# EAGLE design PCB-BI8-3x5C3 (EAGLE 7.1.0)

## Sheet 1 of 2
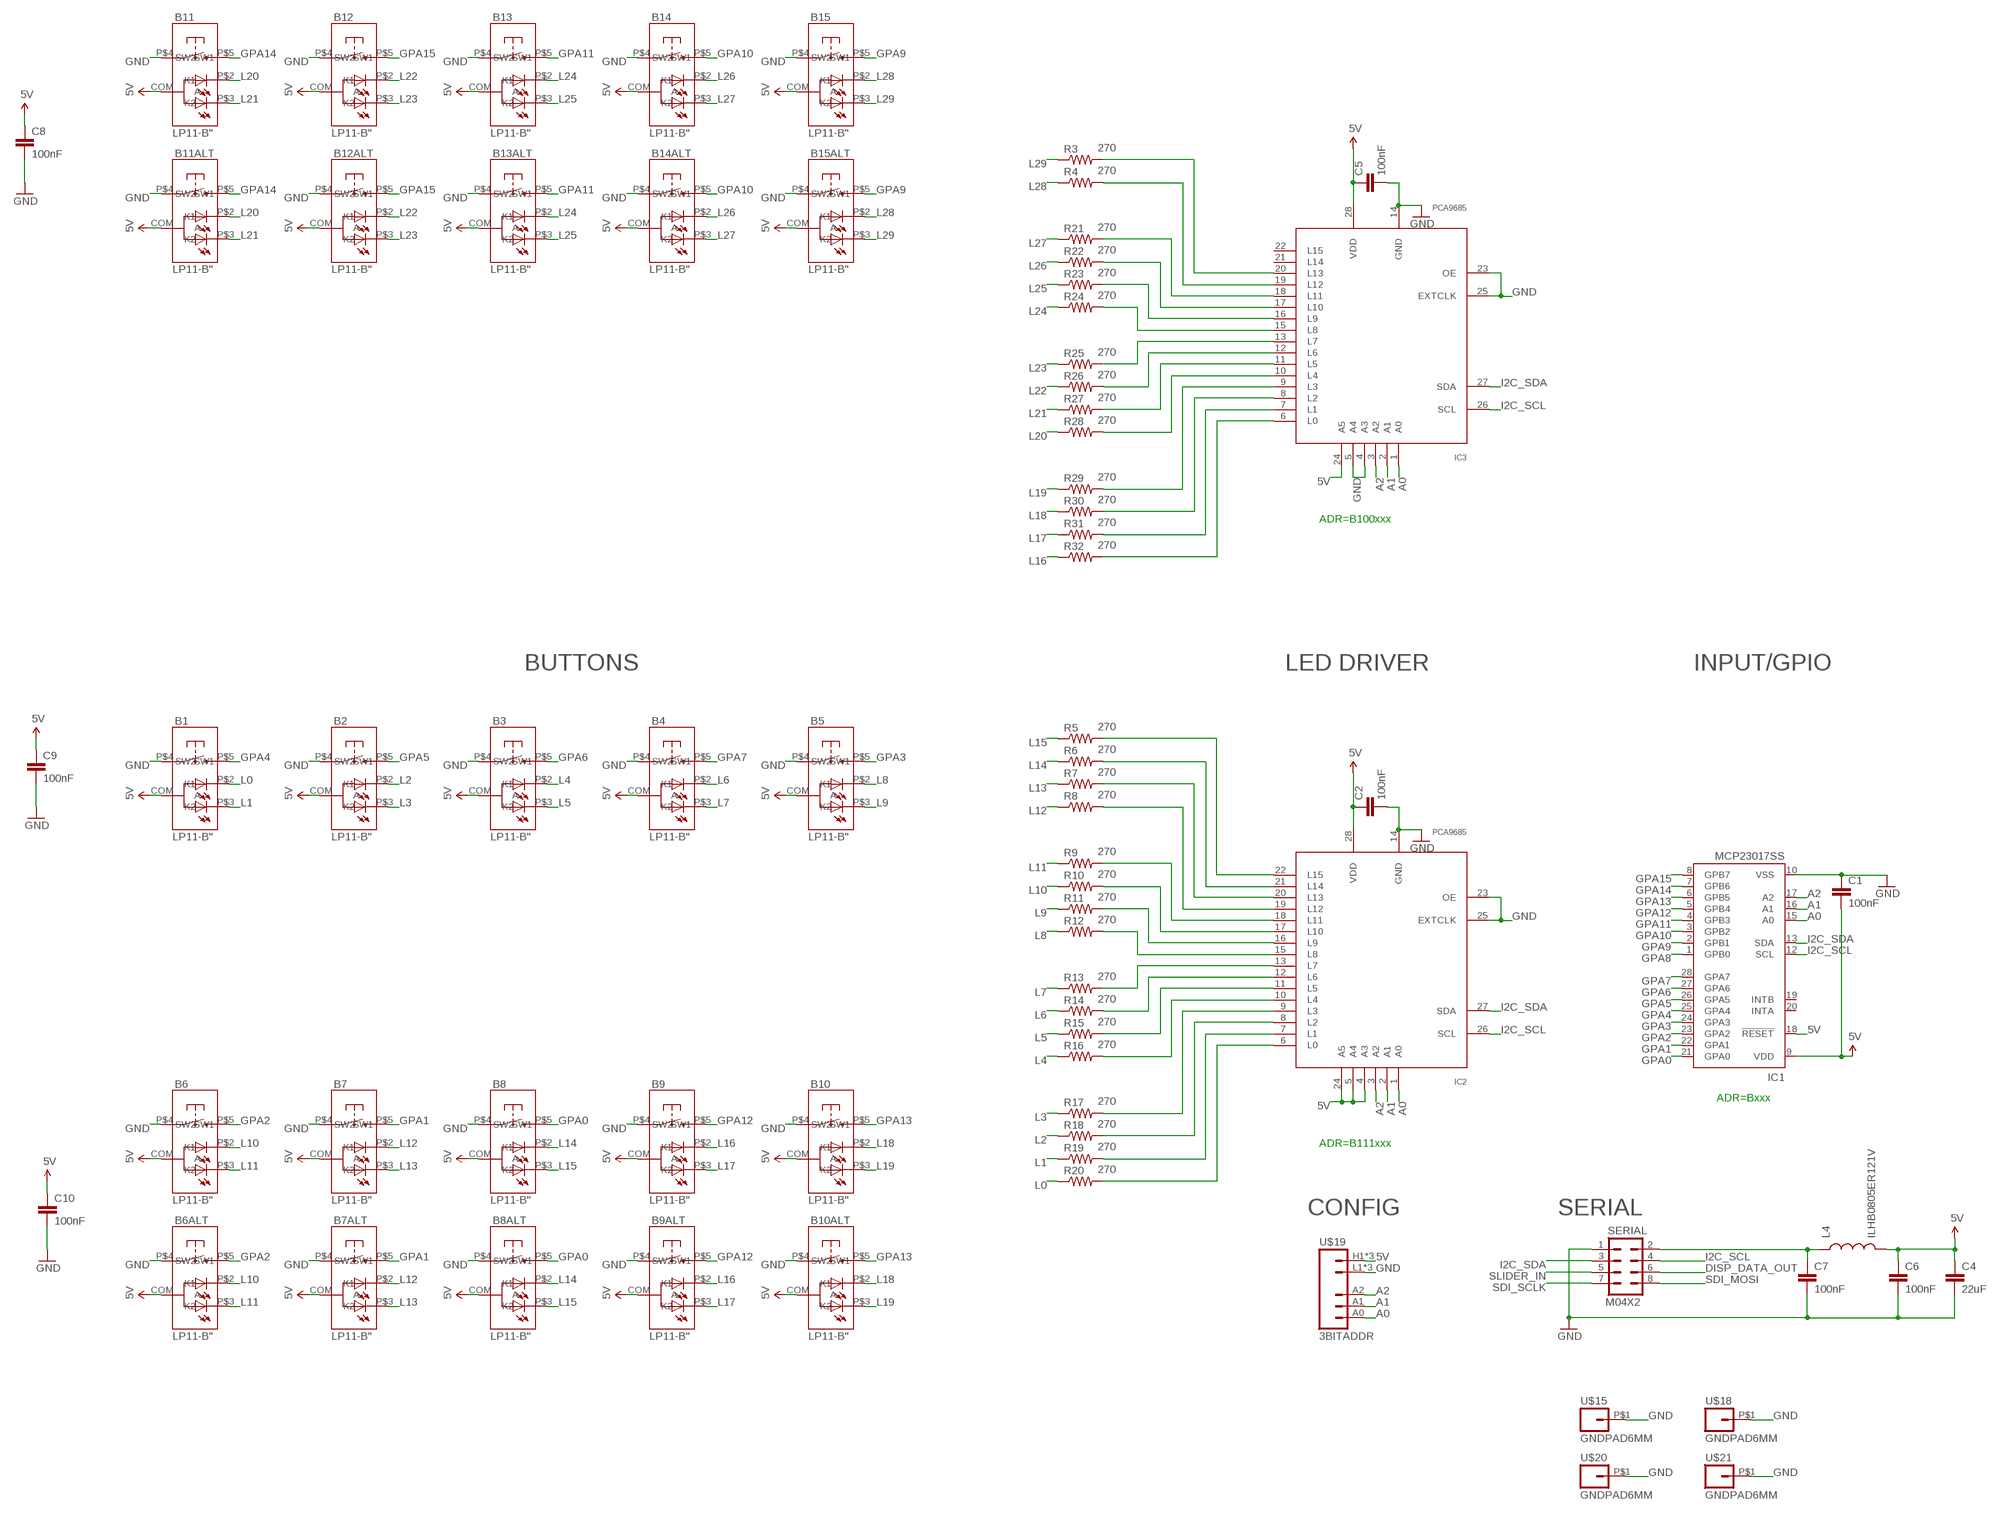
[diagram p0: schematic, sheet 1]

### Parts
B1  LP11-B"  [LP11]
B2  LP11-B"  [LP11]
B3  LP11-B"  [LP11]
B4  LP11-B"  [LP11]
B5  LP11-B"  [LP11]
B6  LP11-B"  [LP11]
B6ALT  LP11-B"  [LP11]
B7  LP11-B"  [LP11]
B7ALT  LP11-B"  [LP11]
B8  LP11-B"  [LP11]
B8ALT  LP11-B"  [LP11]
B9  LP11-B"  [LP11]
B9ALT  LP11-B"  [LP11]
B10  LP11-B"  [LP11]
B10ALT  LP11-B"  [LP11]
B11  LP11-B"  [LP11]
B11ALT  LP11-B"  [LP11]
B12  LP11-B"  [LP11]
B12ALT  LP11-B"  [LP11]
B13  LP11-B"  [LP11]
B13ALT  LP11-B"  [LP11]
B14  LP11-B"  [LP11]
B14ALT  LP11-B"  [LP11]
B15  LP11-B"  [LP11]
B15ALT  LP11-B"  [LP11]
C1  100nF  CAP0603-CAP  [0603-CAP]
C2  100nF  CAP0603-CAP  [0603-CAP]
C4  22uF  CAP0805  [0805]
C5  100nF  CAP0603-CAP  [0603-CAP]
C6  100nF  CAP0603-CAP  [0603-CAP]
C7  100nF  CAP0603-CAP  [0603-CAP]
C8  100nF  CAP0603-CAP  [0603-CAP]
C9  100nF  CAP0603-CAP  [0603-CAP]
C10  100nF  CAP0603-CAP  [0603-CAP]
IC1  MCP23017SS  [SSOP28]
IC2  PCA9685  [TSSOP28]
IC3  PCA9685  [TSSOP28]
L4  ILHB0805ER121V  INDUCTOR0805  [0805]
R3  270  RESISTOR0603-RES  [0603-RES]
R4  270  RESISTOR0603-RES  [0603-RES]
R5  270  RESISTOR0603-RES  [0603-RES]
R6  270  RESISTOR0603-RES  [0603-RES]
R7  270  RESISTOR0603-RES  [0603-RES]
R8  270  RESISTOR0603-RES  [0603-RES]
R9  270  RESISTOR0603-RES  [0603-RES]
R10  270  RESISTOR0603-RES  [0603-RES]
R11  270  RESISTOR0603-RES  [0603-RES]
R12  270  RESISTOR0603-RES  [0603-RES]
R13  270  RESISTOR0603-RES  [0603-RES]
R14  270  RESISTOR0603-RES  [0603-RES]
R15  270  RESISTOR0603-RES  [0603-RES]
R16  270  RESISTOR0603-RES  [0603-RES]
R17  270  RESISTOR0603-RES  [0603-RES]
R18  270  RESISTOR0603-RES  [0603-RES]
R19  270  RESISTOR0603-RES  [0603-RES]
R20  270  RESISTOR0603-RES  [0603-RES]
R21  270  RESISTOR0603-RES  [0603-RES]
R22  270  RESISTOR0603-RES  [0603-RES]
R23  270  RESISTOR0603-RES  [0603-RES]
R24  270  RESISTOR0603-RES  [0603-RES]
R25  270  RESISTOR0603-RES  [0603-RES]
R26  270  RESISTOR0603-RES  [0603-RES]
R27  270  RESISTOR0603-RES  [0603-RES]
R28  270  RESISTOR0603-RES  [0603-RES]
R29  270  RESISTOR0603-RES  [0603-RES]
R30  270  RESISTOR0603-RES  [0603-RES]
R31  270  RESISTOR0603-RES  [0603-RES]
R32  270  RESISTOR0603-RES  [0603-RES]
SERIAL  M04X2  [2X4]
U$15  GNDPAD6MM  [3.2MMPAD6MM]
U$18  GNDPAD6MM  [3.2MMPAD6MM]
U$19  3BITADDR  [3BITADDR]
U$20  GNDPAD6MM  [3.2MMPAD6MM]
U$21  GNDPAD6MM  [3.2MMPAD6MM]

### Nets
5V [Power]: B1.COM(A) B2.COM(A) B3.COM(A) B4.COM(A) B5.COM(A) B6.COM(A) B6ALT.COM(A) B7.COM(A) B7ALT.COM(A) B8.COM(A) B8ALT.COM(A) B9.COM(A) B9ALT.COM(A) B10.COM(A) B10ALT.COM(A) B11.COM(A) B11ALT.COM(A) B12.COM(A) B12ALT.COM(A) B13.COM(A) B13ALT.COM(A) B14.COM(A) B14ALT.COM(A) B15.COM(A) B15ALT.COM(A) C1.2 C2.1 C4.1 C5.1 C6.1 C8.1 C9.1 C10.1 IC1.9(VDD) IC1.18(!RESET) IC2.4(A3) IC2.5(A4) IC2.24(A5) IC2.28(VDD) IC3.24(A5) IC3.28(VDD) L4.2 U$19.H1(VCC) U$19.H2(VCC) U$19.H3(VCC)
A0: IC1.15(A0) IC2.1(A0) IC3.1(A0) U$19.A0
A1: IC1.16(A1) IC2.2(A1) IC3.2(A1) U$19.A1
A2: IC1.17(A2) IC2.3(A2) IC3.3(A2) U$19.A2
DISP_DATA_OUT: SERIAL.6
GND [Power]: B1.P$4(SW1) B2.P$4(SW1) B3.P$4(SW1) B4.P$4(SW1) B5.P$4(SW1) B6.P$4(SW1) B6ALT.P$4(SW1) B7.P$4(SW1) B7ALT.P$4(SW1) B8.P$4(SW1) B8ALT.P$4(SW1) B9.P$4(SW1) B9ALT.P$4(SW1) B10.P$4(SW1) B10ALT.P$4(SW1) B11.P$4(SW1) B11ALT.P$4(SW1) B12.P$4(SW1) B12ALT.P$4(SW1) B13.P$4(SW1) B13ALT.P$4(SW1) B14.P$4(SW1) B14ALT.P$4(SW1) B15.P$4(SW1) B15ALT.P$4(SW1) C1.1 C2.2 C4.2 C5.2 C6.2 C7.2 C8.2 C9.2 C10.2 IC1.10(VSS) IC2.14(GND) IC2.23(OE) IC2.25(EXTCLK) IC3.4(A3) IC3.5(A4) IC3.14(GND) IC3.23(OE) IC3.25(EXTCLK) SERIAL.1 U$15.P$1 U$18.P$1 U$19.L1(GND) U$19.L2(GND) U$19.L3(GND) U$20.P$1 U$21.P$1
GPA0: B8.P$5(SW2) B8ALT.P$5(SW2) IC1.21(GPA0)
GPA1: B7.P$5(SW2) B7ALT.P$5(SW2) IC1.22(GPA1)
GPA2: B6.P$5(SW2) B6ALT.P$5(SW2) IC1.23(GPA2)
GPA3: B5.P$5(SW2) IC1.24(GPA3)
GPA4: B1.P$5(SW2) IC1.25(GPA4)
GPA5: B2.P$5(SW2) IC1.26(GPA5)
GPA6: B3.P$5(SW2) IC1.27(GPA6)
GPA7: B4.P$5(SW2) IC1.28(GPA7)
GPA8: IC1.1(GPB0)
GPA9: B15.P$5(SW2) B15ALT.P$5(SW2) IC1.2(GPB1)
GPA10: B14.P$5(SW2) B14ALT.P$5(SW2) IC1.3(GPB2)
GPA11: B13.P$5(SW2) B13ALT.P$5(SW2) IC1.4(GPB3)
GPA12: B9.P$5(SW2) B9ALT.P$5(SW2) IC1.5(GPB4)
GPA13: B10.P$5(SW2) B10ALT.P$5(SW2) IC1.6(GPB5)
GPA14: B11.P$5(SW2) B11ALT.P$5(SW2) IC1.7(GPB6)
GPA15: B12.P$5(SW2) B12ALT.P$5(SW2) IC1.8(GPB7)
I2C_SCL: IC1.12(SCL) IC2.26(SCL) IC3.26(SCL) SERIAL.4
I2C_SDA: IC1.13(SDA) IC2.27(SDA) IC3.27(SDA) SERIAL.3
L0: B1.P$2(K1) R20.1
L1: B1.P$3(K2) R19.1
L2: B2.P$2(K1) R18.1
L3: B2.P$3(K2) R17.1
L4: B3.P$2(K1) R16.1
L5: B3.P$3(K2) R15.1
L6: B4.P$2(K1) R14.1
L7: B4.P$3(K2) R13.1
L8: B5.P$2(K1) R12.1
L9: B5.P$3(K2) R11.1
L10: B6.P$2(K1) B6ALT.P$2(K1) R10.1
L11: B6.P$3(K2) B6ALT.P$3(K2) R9.1
L12: B7.P$2(K1) B7ALT.P$2(K1) R8.1
L13: B7.P$3(K2) B7ALT.P$3(K2) R7.1
L14: B8.P$2(K1) B8ALT.P$2(K1) R6.1
L15: B8.P$3(K2) B8ALT.P$3(K2) R5.1
L16: B9.P$2(K1) B9ALT.P$2(K1) R32.1
L17: B9.P$3(K2) B9ALT.P$3(K2) R31.1
L18: B10.P$2(K1) B10ALT.P$2(K1) R30.1
L19: B10.P$3(K2) B10ALT.P$3(K2) R29.1
L20: B11.P$2(K1) B11ALT.P$2(K1) R28.1
L21: B11.P$3(K2) B11ALT.P$3(K2) R27.1
L22: B12.P$2(K1) B12ALT.P$2(K1) R26.1
L23: B12.P$3(K2) B12ALT.P$3(K2) R25.1
L24: B13.P$2(K1) B13ALT.P$2(K1) R24.1
L25: B13.P$3(K2) B13ALT.P$3(K2) R23.1
L26: B14.P$2(K1) B14ALT.P$2(K1) R22.1
L27: B14.P$3(K2) B14ALT.P$3(K2) R21.1
L28: B15.P$2(K1) B15ALT.P$2(K1) R4.1
L29: B15.P$3(K2) B15ALT.P$3(K2) R3.1
N$1: IC3.13(L7) R25.2
N$2: IC3.12(L6) R26.2
N$3: IC3.11(L5) R27.2
N$4: IC2.13(L7) R13.2
N$5: IC2.12(L6) R14.2
N$6: IC3.10(L4) R28.2
N$7: IC2.11(L5) R15.2
N$8: IC3.9(L3) R29.2
N$9: IC2.10(L4) R16.2
N$10: IC2.9(L3) R17.2
N$11: IC2.8(L2) R18.2
N$12: IC2.7(L1) R19.2
N$13: IC3.8(L2) R30.2
N$14: IC3.7(L1) R31.2
N$15: IC3.6(L0) R32.2
N$16: IC3.15(L8) R24.2
N$17: IC3.16(L9) R23.2
N$18: IC3.17(L10) R22.2
N$19: IC2.6(L0) R20.2
N$20: IC2.15(L8) R12.2
N$21: IC2.16(L9) R11.2
N$22: IC2.17(L10) R10.2
N$23: IC2.18(L11) R9.2
N$24: IC2.19(L12) R8.2
N$25: IC2.20(L13) R7.2
N$26: IC2.21(L14) R6.2
N$27: IC2.22(L15) R5.2
N$28: IC3.18(L11) R21.2
N$29: IC3.19(L12) R4.2
N$30: IC3.20(L13) R3.2
N$33 [Power]: C7.1 L4.1 SERIAL.2
SDI_MOSI: SERIAL.8
SDI_SCLK: SERIAL.7
SLIDER_IN: SERIAL.5
Unconnected: IC1.19(INTB) IC1.20(INTA) IC3.21(L14) IC3.22(L15)

### Notes on the sheet
- ADR=B100xxx
- BUTTONS | LED DRIVER | INPUT/GPIO
- ADR=Bxxx
- ADR=B111xxx
- CONFIG | SERIAL

## Sheet 2 of 2

## Library data of the parts
B1-B6 B6ALT B7 B7ALT B8 B8ALT B9 B9ALT B10 B10ALT B11 B11ALT B12 B12ALT B13 B13ALT B14 B14ALT B15 B15ALT = SKAARHOJ:LP11-B
C1 C2 C4-C10 = SparkFun:CAP: Capacitor Standard 0603 ceramic capacitor, and 0.1" leaded capacitor.
IC1 = microchip:MCP23017: http://ww1.microchip.com/downloads/en/DeviceDoc/21952a.pdf Source: http://ww1.microchip.com/downloads/en/DeviceDoc/21952a.pdf; MF: MICROCHIP; MPN: MCP23017-E/SS; OC_FARNELL: 1467674; OC_NEWARK: 31K2960
IC2 IC3 = wsmith:PCA9685
L4 = SparkFun:INDUCTOR: Inductors Basic Inductor/Choke - 0603 and 1206. Footprints are not proven and vary greatly between part numbers.
R3-R32 = SparkFun:RESISTOR: Resistor Basic schematic elements and footprints for 0603, 1206, and PTH resistors.
SERIAL = SparkFun:M04X2
U$15 U$18 U$20 U$21 = SKAARHOJ:GNDPAD
U$19 = SKAARHOJ:3BITADDR

## Net classes
0 default: width 0.203 mm, drill 0.406 mm, clearance 0.203 mm
1 Power: width 0.406 mm, drill 0.61 mm, clearance 0.203 mm

## Board
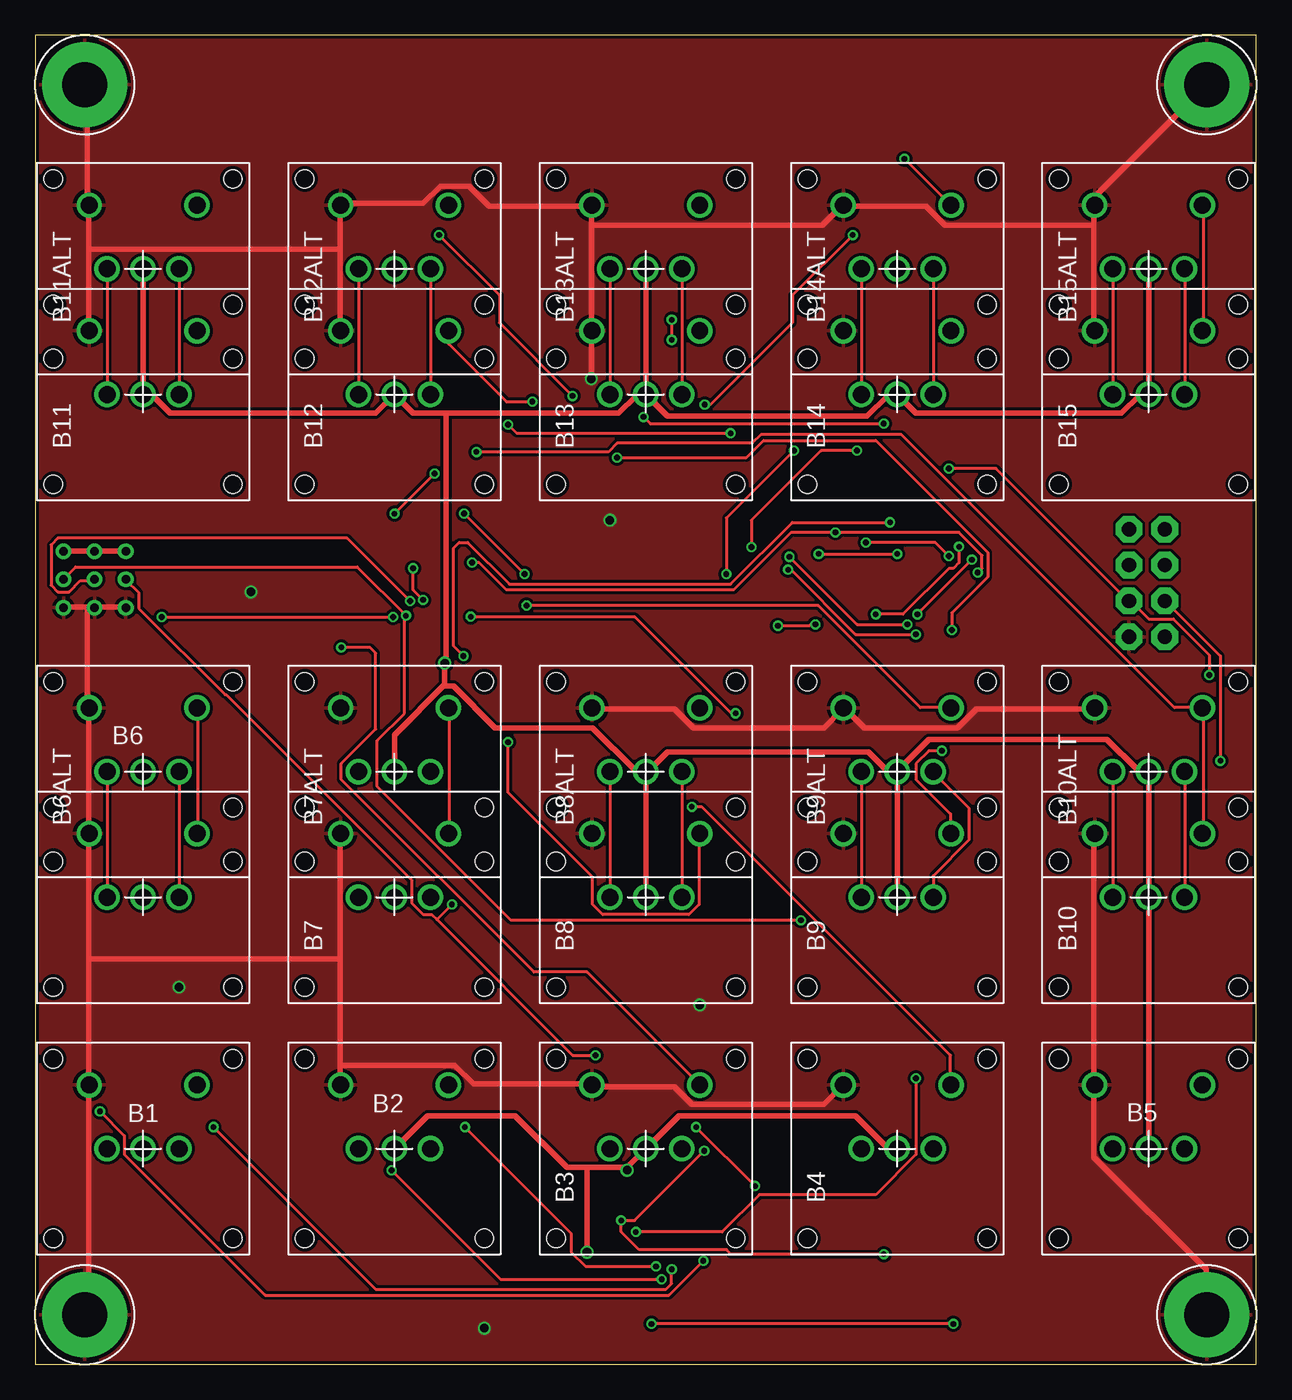
[diagram p1: board, top side]
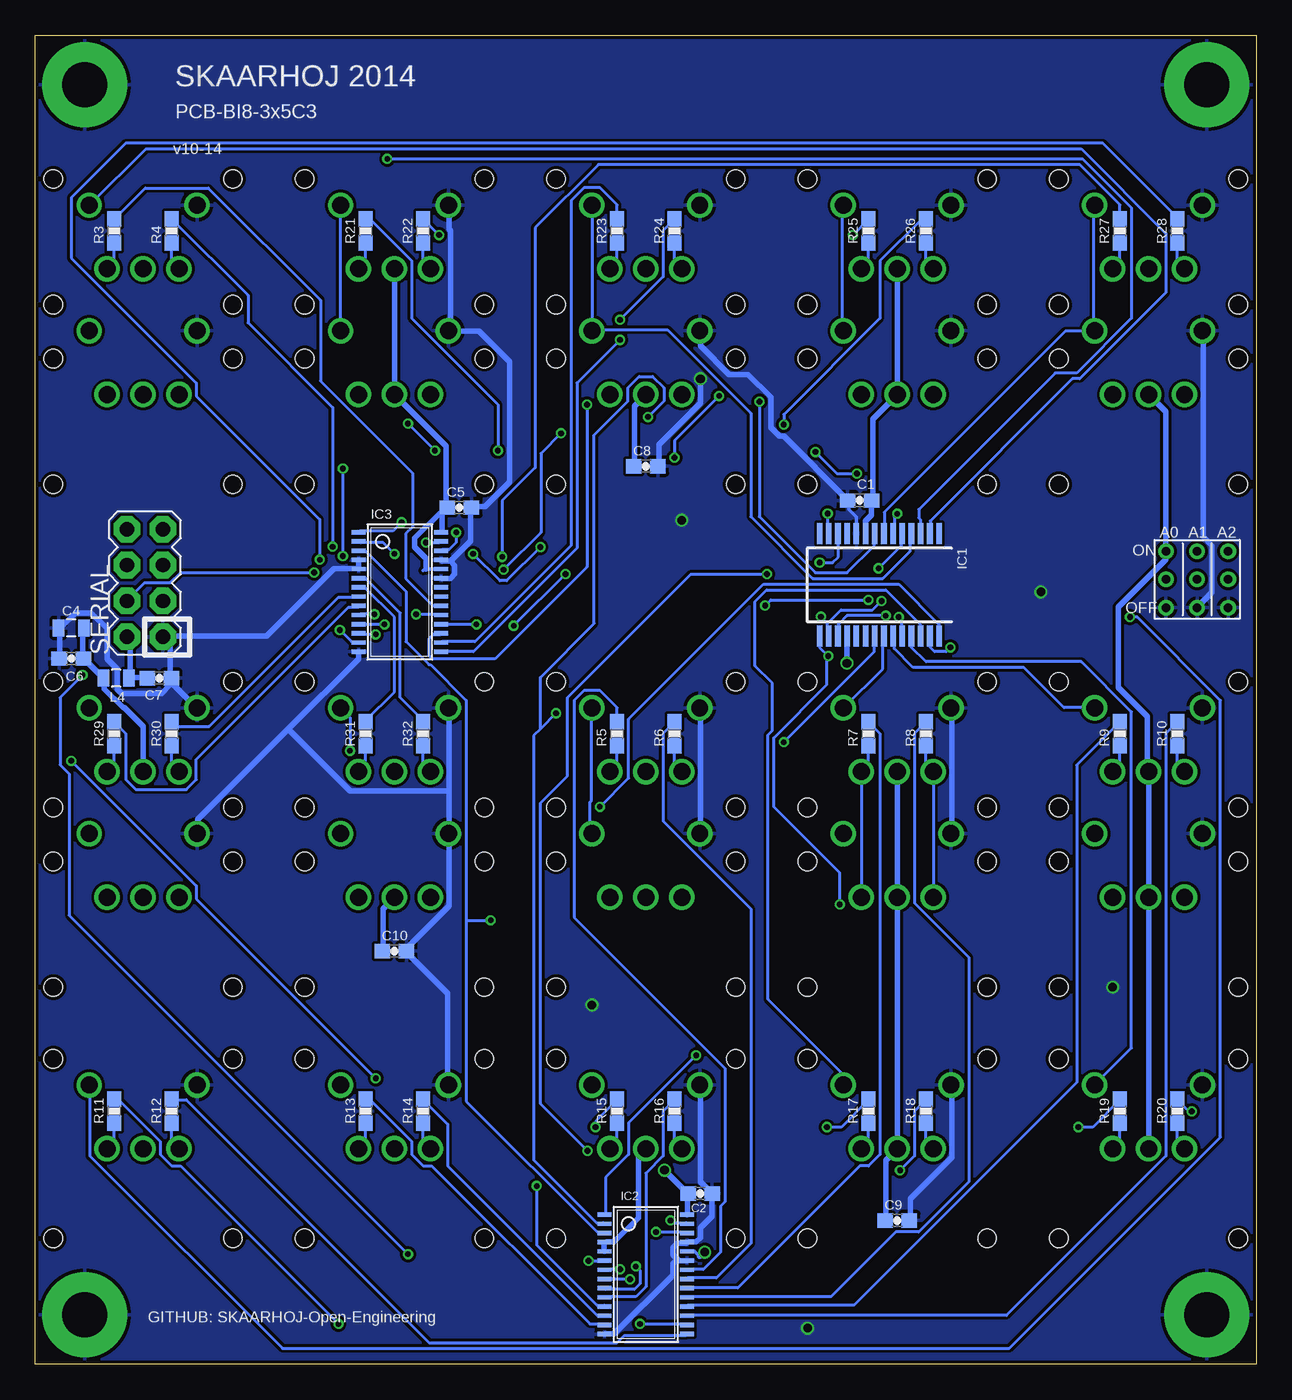
[diagram p2: board, bottom side, seen from below]

Size 86.36 x 93.98 mm. Coordinates in mm from the lower left corner, seen from the top.
Outline: 0,0 86.36,0 86.36,93.98 0,93.98 0,0
Copper layers (1*16): Top 0.035mm / dielectric 1.5mm / Bottom 0.035mm
Design rules "Fusion_eagle_rule_v1.1": minimum track width 6mil, minimum drill 12mil, track to track 6mil, track to pad 6mil, pad to pad 6mil, via to via 6mil, smd to smd 0mil, copper to edge 10mil, drill to drill 10mil, minimum pad ring 10mil, minimum via ring 6mil, stop-mask expansion 2mil, vias tented up to drill 100mil, thermal gap 10mil

### Footprints (pad centres in the part's own frame; a part is rotated, then mirrored left to right if it is on the bottom)
LP11 = drill 1.2: COM 0,0; P$2 0,2.54; P$3 0,-2.54; P$4 4.5,3.81; P$5 4.5,-3.81 | hole 1.3: -6.35,6.35; 6.35,6.35; 6.35,-6.35; -6.35,-6.35
0603-CAP = smd 1.1 x 1: 1 -0.85,0; 2 0.85,0
0805 = smd 0.8 x 1.2: 1 -0.9,0; 2 0.9,0
SSOP28 = smd 0.4 x 1.5: 1 -4.225,-3.625; 2 -3.575,-3.625; 3 -2.925,-3.625; 4 -2.275,-3.625; 5 -1.625,-3.625; 6 -0.975,-3.625; 7 -0.325,-3.625; 8 0.325,-3.625; 9 0.975,-3.625; 10 1.625,-3.625; 11 2.275,-3.625; 12 2.925,-3.625; 13 3.575,-3.625; 14 4.225,-3.625; 15 4.225,3.625; 16 3.575,3.625; 17 2.925,3.625; 18 2.275,3.625; 19 1.625,3.625; 20 0.975,3.625; 21 0.325,3.625; 22 -0.325,3.625; 23 -0.975,3.625; 24 -1.625,3.625; 25 -2.275,3.625; 26 -2.925,3.625; 27 -3.575,3.625; 28 -4.225,3.625
TSSOP28 = smd 0.305 x 0.991: 1 -4.225,-2.918; 2 -3.575,-2.918; 3 -2.925,-2.918; 4 -2.275,-2.918; 5 -1.625,-2.918; 6 -0.975,-2.918; 7 -0.325,-2.918; 8 0.325,-2.918; 9 0.975,-2.918; 10 1.625,-2.918; 11 2.275,-2.918; 12 2.925,-2.918; 13 3.575,-2.918; 14 4.225,-2.918; 15 4.225,2.918; 16 3.575,2.918; 17 2.925,2.918; 18 2.275,2.918; 19 1.625,2.918; 20 0.975,2.918; 21 0.325,2.918; 22 -0.325,2.918; 23 -0.975,2.918; 24 -1.625,2.918; 25 -2.275,2.918; 26 -2.925,2.918; 27 -3.575,2.918; 28 -4.225,2.918
0603-RES = smd 1.1 x 1: 1 -0.85,0; 2 0.85,0
2X4 = drill 1.016 pad 1.88 octagon: 1 -3.81,-1.27; 2 -3.81,1.27; 3 -1.27,-1.27; 4 -1.27,1.27; 5 1.27,-1.27; 6 1.27,1.27; 7 3.81,-1.27; 8 3.81,1.27
3.2MMPAD6MM = drill 3.2 pad 6: P$1 0,0
3BITADDR = drill 0.6: A0 -2.2,0; A1 0,0; A2 2.2,0; H1 -2.2,2; H2 0,2; H3 2.2,2; L1 -2.2,-2; L2 0,-2; L3 2.2,-2

### Placement (x,y rotation side)
B1  7.62,15.24 90 top
B2  25.4,15.24 90 top
B3  43.18,15.24 90 top
B4  60.96,15.24 90 top
B5  78.74,15.24 90 top
B6  7.62,33.02 90 top
B6ALT  7.62,41.91 90 top
B7  25.4,33.02 90 top
B7ALT  25.4,41.91 90 top
B8  43.18,33.02 90 top
B8ALT  43.18,41.91 90 top
B9  60.96,33.02 90 top
B9ALT  60.96,41.91 90 top
B10  78.74,33.02 90 top
B10ALT  78.74,41.91 90 top
B11  7.62,68.58 90 top
B11ALT  7.62,77.47 90 top
B12  25.4,68.58 90 top
B12ALT  25.4,77.47 90 top
B13  43.18,68.58 90 top
B13ALT  43.18,77.47 90 top
B14  60.96,68.58 90 top
B14ALT  60.96,77.47 90 top
B15  78.74,68.58 90 top
B15ALT  78.74,77.47 90 top
C1  28.07,61.09 0 bottom
C2  39.34,12.06 0 bottom
C4  83.82,52.07 180 bottom
C5  56.36,60.58 0 bottom
C6  83.82,49.91 180 bottom
C7  77.6,48.51 0 bottom
C8  43.18,63.5 0 bottom
C9  25.4,10.16 0 bottom
C10  60.96,29.21 0 bottom
IC1  26.67,55.12 180 bottom
IC2  43.18,6.35 270 bottom
IC3  60.58,54.61 270 bottom
L4  80.64,48.51 180 bottom
R3  80.77,80.14 90 bottom
R4  76.71,80.14 90 bottom
R5  45.21,44.58 90 bottom
R6  41.15,44.58 90 bottom
R7  27.43,44.58 90 bottom
R8  23.37,44.58 90 bottom
R9  9.65,44.58 90 bottom
R10  5.59,44.58 90 bottom
R11  80.77,17.91 90 bottom
R12  76.71,17.91 90 bottom
R13  62.99,17.91 90 bottom
R14  58.93,17.91 90 bottom
R15  45.21,17.91 90 bottom
R16  41.15,17.91 90 bottom
R17  27.43,17.91 90 bottom
R18  23.37,17.91 90 bottom
R19  9.65,17.91 90 bottom
R20  5.59,17.91 90 bottom
R21  62.99,80.14 90 bottom
R22  58.93,80.14 90 bottom
R23  45.21,80.14 90 bottom
R24  41.15,80.14 90 bottom
R25  27.43,80.14 90 bottom
R26  23.37,80.14 90 bottom
R27  9.65,80.14 90 bottom
R28  5.59,80.14 90 bottom
R29  80.77,44.58 90 bottom
R30  76.71,44.58 90 bottom
R31  62.99,44.58 90 bottom
R32  58.93,44.58 90 bottom
SERIAL  78.61,55.24 90 bottom
U$15  3.5,3.5 0 top
U$18  82.86,3.5 0 top
U$19  4.19,55.5 0 bottom
U$20  3.5,90.48 0 top
U$21  82.86,90.48 0 top

### Tracks (layer width: path | path; a pad name or v marks a point on that pad's centre or on a via)
5V  (via drill 0.61)
  Top 0.406: U$19.H3 2.03,57.51 4.17,57.51 U$19.H2 4.37,57.51 6.3,57.51 U$19.H1 | B11ALT.COM B11.COM 7.72,68.48 8.33,68.48 9.55,67.26 24.08,67.26 B12.COM 26.72,67.26 29.06,67.26 | B5.COM B10.COM B10ALT.COM 78.64,42.06 77.93,42.06 75.79,44.2 63.2,44.2 61.06,42.06 B9ALT.COM | B15ALT.COM B15.COM 78.64,68.48 78.03,68.48 76.81,67.26 62.28,67.26 B14.COM 60.86,68.48 60.25,68.48 58.83,67.06 44.7,67.06 B13.COM | B13.COM B13ALT.COM | 29.06,67.26 41.25,67.26 42.47,68.48 43.08,68.48 B13.COM | B4.COM 60.35,15.24 58.01,17.58 45.52,17.58 B3.COM 41.86,13.92 v41.86,13.72 41.76,13.92 39.01,13.92 | B9.COM B9ALT.COM | B8ALT.COM B8.COM | 28.96,48.06 v28.96,49.58 29.06,49.68 29.06,67.26 | 28.96,48.06 25.4,44.5 B7ALT.COM | B8ALT.COM 43.08,42.06 42.37,42.06 39.42,45.01 32.51,45.01 29.57,47.95 29.06,47.95 28.96,48.06 | B9ALT.COM 60.86,42.06 60.15,42.06 58.93,43.28 44.7,43.28 43.38,41.96 B8ALT.COM | 39.01,13.92 37.59,13.92 33.93,17.58 27.74,17.58 B2.COM | 39.01,13.92 v39.01,7.92
  Bottom 0.254: IC3.24 58.74,56.23 58.83,56.23 58.93,56.13 | IC2.24 39.73,7.97 39.4,7.64 39.37,7.62
  Bottom 0.406: B11.COM 6.4,67.36 U$19.H1 6.4,57.3 6.4,56.9 9.75,53.54 9.75,47.85 7.72,45.82 7.72,42.06 B6ALT.COM B6.COM B1.COM | C4.1 83.01,52.02 83.01,50.09 C6.1 82.91,49.89 81.58,48.56 L4.2 81.48,48.36 81.48,47.75 80.16,46.43 80.06,46.43 78.74,45.11 B10ALT.COM | 57.61,60.25 57.61,58.93 IC3.28 | 57.61,60.25 57.3,60.55 C5.1 57.3,60.76 57.3,64.92 B14.COM B14ALT.COM | B13.COM 43.99,67.77 43.99,63.5 C8.1 | IC1.9 27.64,58.83 27.64,59.64 27.23,60.05 27.23,61.06 C1.2 27.13,61.27 27.13,66.85 B12.COM B12ALT.COM | IC2.28 40.23,10.67 40.23,11.99 C2.1 40.34,12.19 v41.86,13.72 | IC2.5 46.13,8.03 46.13,8.53 IC2.4 45.92,8.64 45.41,8.64 43.69,10.36 43.69,14.73 B3.COM | B9.COM 61.77,32.21 61.77,29.26 C10.1 | C9.1 26.21,10.16 26.21,14.43 B2.COM B7.COM B7ALT.COM | v28.96,49.58 28.96,51.41 IC1.18 | 58.74,56.23 58.74,56.99 59.53,57.78 59.53,58.42 57.78,60.17 57.61,60.25 | 39.4,7.64 39.12,7.92 v39.01,7.92
A0  (via drill 0.41)
  Top 0.203: v60.45,59.54 53.54,59.54 49.17,55.17 33.53,55.17 30.58,58.12 29.97,58.12 29.57,57.71 29.57,50.8 v30.28,50.09 | v39.62,21.84 38,21.84 28.4,31.45 | 28.4,31.45 28.04,31.8 27.43,31.8 26.62,32.61 26.62,34.24 13.51,47.35 13.41,47.35 7.32,53.44 7.32,54.56 6.4,55.47 U$19.A0 | 28.4,31.45 v29.46,32.51
  Bottom 0.203: v60.45,59.54 61.06,58.93 63.4,58.93 IC3.1 | IC1.15 30.89,51.41 30.89,50.7 v30.28,50.09 30.38,50.09 30.38,48.06 34.14,44.3 34.14,39.42 29.46,34.75 v29.46,32.51 | v39.62,21.84 44.4,17.07 44.4,14.83 46.02,13.21 46.02,10.67 IC2.1
A1  (via drill 0.41)
  Top 0.203: v49.53,46.04 49.21,46.04 42.39,52.86 v30.8,52.86 | v55.4,57.31 v60.96,57.31 | v50.64,57.78 50.64,59.69 55.56,64.61 v58.1,64.61 | v60.01,66.52 43.5,66.52 v43.02,66.99 | v26.51,53.98 22.07,58.42 1.59,58.42 1.11,57.94 1.11,55.09 1.59,54.61 2.38,54.61 3.17,55.4 4.13,55.4 U$19.A1
  Bottom 0.203: v49.53,46.04 50.64,44.93 | 50.64,44.93 51.12,44.45 51.12,14.45 46.67,10 46.2,10 IC2.2 | 30.32,52.39 v30.8,52.86 | 30.32,52.39 30.32,51.59 IC1.16 | v60.96,57.31 61.75,58.1 63.34,58.1 IC3.2 | v55.4,57.31 53.5,55.4 53.02,55.4 v50.64,57.78 | v60.01,66.52 v58.1,64.61 | v43.02,66.99 41.91,68.1 41.91,69.06 42.7,69.85 43.66,69.85 44.45,69.06 44.45,68.1 46.83,65.72 46.83,52.39 50.64,48.58 50.64,44.93 | v26.51,53.98 27.15,53.34 29.37,53.34 30.32,52.39
A2  (via drill 0.41)
  Top 0.203: U$19.A2 2.03,55.58 2.85,56.39 22.76,56.39 v26.21,52.93 26.11,52.93 26.11,46.02 24.18,44.09 24.18,40.84 33.63,31.39 v54.15,31.39
  Bottom 0.203: v26.21,52.93 28.96,52.93 29.57,52.32 29.57,51.51 IC1.17 | 55.88,31.39 55.88,46.94 58.42,49.48 58.52,49.48 60.15,51.1 60.15,54.66 62.99,57.51 63.4,57.51 IC3.3 | 55.88,31.39 55.88,18.59 46.63,9.35 46.13,9.35 IC2.3 | 55.88,31.39 v54.15,31.39
GND  (via drill 0.6, 0.61)
  Top 0.406: 21.54,78.84 21.54,81.89 B12ALT.P$4 21.74,82.09 27.43,82.09 28.65,83.31 30.68,83.31 32.11,81.89 39.12,81.89 B13ALT.P$4 39.32,81.89 39.32,80.57 | 21.54,78.84 21.54,73.15 B12.P$4 | 3.76,78.84 3.76,81.89 B11ALT.P$4 3.66,82.09 3.66,90.32 U$20.P$1 | 3.76,78.84 3.76,73.15 B11.P$4 | 3.76,78.84 21.54,78.84 | v39.32,69.7 39.32,73.05 B13.P$4 39.32,73.25 39.32,80.57 | 74.88,80.57 74.88,81.89 B15ALT.P$4 75.08,82.09 75.08,82.7 U$21.P$1 | 74.88,80.57 74.88,73.15 B15.P$4 | 74.88,80.57 64.31,80.57 62.99,81.89 57.2,81.89 B14ALT.P$4 57,81.89 55.68,80.57 39.32,80.57 | 21.54,28.65 21.54,37.49 B7.P$4 | 21.54,28.65 21.54,21.13 | 21.54,21.13 21.54,19.81 B2.P$4 | 21.54,21.13 29.67,21.13 30.99,19.81 39.32,19.81 B3.P$4 39.52,19.61 45.21,19.61 46.43,18.39 55.78,18.39 57.1,19.71 B4.P$4 | U$19.L3 2.03,53.54 4.17,53.54 U$19.L2 | U$19.L1 6.3,53.54 4.37,53.54 U$19.L2 | U$19.L2 3.66,53.44 3.66,46.53 B6ALT.P$4 3.76,46.33 3.76,37.59 B6.P$4 3.76,37.39 3.76,28.65 | U$15.P$1 3.76,3.76 3.76,19.71 B1.P$4 3.76,19.91 3.76,28.65 | 3.76,28.65 21.54,28.65 | B10.P$4 74.88,37.49 74.88,19.81 B5.P$4 74.88,19.61 74.88,14.63 82.8,6.71 82.8,3.56 U$18.P$1 | B8ALT.P$4 39.42,46.33 45.21,46.33 46.53,45.01 55.78,45.01 57.1,46.33 B9ALT.P$4 57.3,46.33 58.62,45.01 65.23,45.01 66.55,46.33 74.88,46.33 B10ALT.P$4
  Bottom 0.254: IC1.10 28.3,59.92 28.83,60.45 28.83,61 C1.1
  Bottom 0.406: v39.32,69.7 39.32,67.97 42.27,65.02 42.27,63.5 C8.2 | C1.1 28.96,61.16 33.43,65.63 33.73,65.63 34.34,66.24 34.34,68.38 35.97,70 37.29,70 39.32,72.03 39.32,73.05 B13.P$4 | 57,56.79 56.69,56.49 56.69,55.88 57,55.58 57.61,55.58 IC3.23 | 57,56.79 57.61,56.79 IC3.25 | 57,56.79 55.58,58.22 55.58,60.55 C5.2 55.37,60.66 54.56,60.66 52.83,62.38 52.83,70.92 54.97,73.05 57.1,73.05 B14.P$4 57,73.15 57,80.16 57.1,80.26 57.1,81.89 B14ALT.P$4 | 40.95,7.42 41.25,7.72 41.25,8.23 40.95,8.53 40.34,8.53 IC2.25 40.13,8.64 39.62,8.64 39.32,8.94 39.32,9.65 38.51,10.46 38.51,11.99 C2.2 38.61,12.19 39.32,12.9 39.32,19.71 B3.P$4 | 40.95,7.42 40.84,7.32 40.34,7.32 IC2.23 | 40.95,7.42 41.25,7.11 41.25,6.3 45.41,2.13 46.02,2.13 IC2.14 | C9.2 24.49,10.16 24.49,11.68 21.54,14.63 21.54,19.71 B2.P$4 | B7.P$4 21.54,37.59 21.54,46.33 B7ALT.P$4 | 63.5,50.39 IC3.14 63.5,50.19 63.5,49.89 68.48,44.91 | 68.48,44.91 74.88,38.51 74.88,37.59 B10.P$4 | C6.2 84.63,49.99 84.63,52.02 C4.2 84.53,52.12 83.52,53.14 82.4,53.14 81.28,52.02 81.28,49.89 80.57,49.17 80.57,47.75 80.26,47.45 77.42,47.45 76.81,48.06 C7.2 | C7.2 76.71,48.46 76.71,48.16 74.98,46.43 B10ALT.P$4 | IC3.4 63.5,56.79 63.5,56.29 IC3.5 63.7,56.29 65.23,56.29 70,51.51 77.32,51.51 SERIAL.1 76.81,51.41 76.81,48.67 C7.2 | B8.P$4 39.32,37.59 39.32,46.33 B8ALT.P$4 | B4.P$4 57.2,19.81 57.2,26.21 60.05,29.06 C10.2 60.05,29.26 60.05,29.46 57.1,32.41 57.1,37.49 B9.P$4 57.1,37.69 57.1,40.54 | 57.1,40.54 57.1,46.33 B9ALT.P$4 | 68.48,44.91 64.11,40.54 57.1,40.54 | B11.P$4 3.76,73.05 3.76,58.52 3.15,57.91 3.15,54.56 4.17,53.54 U$19.L2
  other vias: 10.16,26.67 31.75,2.54 46.99,25.4 40.64,59.69 15.24,54.61
  pour Top: 0,0 86.36,0 86.36,93.98 0,93.98
  pour Bottom: 0,0 86.36,0 86.36,93.98 0,93.98
GPA0  (via drill 0.41)
  Top 0.203: v33.43,43.99 33.43,40.44 39.42,34.44 39.42,32.51 40.13,31.8 46.23,31.8 46.94,32.51 46.94,37.49 B8.P$5
  Bottom 0.203: v33.43,43.99 27.03,50.39 27.03,51.41 IC1.21 | B8ALT.P$5 47.04,46.33 47.04,39.83 47.14,39.73 47.14,37.69 47.04,37.59 B8.P$5
GPA1
  Top 0.203: B7.P$5 29.26,37.59 29.26,46.33 B7ALT.P$5
  Bottom 0.203: IC1.22 26.42,51.41 26.42,49.17 29.16,46.43 B7ALT.P$5
GPA2
  Top 0.203: B6.P$5 11.48,37.59 11.48,46.33 B6ALT.P$5
  Bottom 0.203: IC1.23 25.6,51.41 25.6,50.6 24.28,49.28 16.46,49.28 13.61,46.43 11.48,46.43 B6ALT.P$5
GPA3  (via drill 0.41)
  Top 0.203: v8.94,52.83 v25.3,52.83
  Bottom 0.203: v25.3,52.83 25.09,52.63 25.09,51.51 IC1.24 | v8.94,52.83 8.43,52.83 2.54,46.94 2.54,16.05 17.48,1.12 68.89,1.12 82.5,14.73 82.5,19.71 B5.P$5
GPA4
  Bottom 0.203: IC1.25 24.38,51.41 24.38,50.7 23.37,49.68 12.39,49.68 8.84,46.13 8.84,22.35 11.38,19.81 B1.P$5
GPA5
  Bottom 0.203: IC1.26 23.77,51.51 23.77,52.32 26.21,54.76 34.65,54.76 35.46,53.95 35.46,49.38 34.24,48.16 34.24,44.81 34.54,44.5 34.54,25.81 29.26,20.52 29.26,19.81 B2.P$5
GPA6  (via drill 0.41)
  Top 0.203: v21.64,50.7 23.67,50.7 24.08,50.29 24.08,44.91 21.64,42.47 21.64,41.35 35.26,27.74 39.01,27.74 46.94,19.81 B3.P$5
  Bottom 0.203: v21.64,50.7 21.95,50.39 22.76,50.39 23.06,50.7 23.06,51.41 IC1.27
GPA7  (via drill 0.41)
  Top 0.203: v46.43,39.42 47.14,39.42 64.72,21.84 64.72,19.81 B4.P$5
  Bottom 0.203: v46.43,39.42 44.4,41.45 44.4,45.62 34.85,55.17 25.3,55.17 22.45,52.32 22.45,51.51 IC1.28
GPA9
  Top 0.203: B15.P$5 82.6,73.15 82.6,81.89 B15ALT.P$5
  Bottom 0.203: IC1.2 23.06,58.83 23.06,59.64 13.01,69.7 12.5,69.7 6.4,75.79 6.4,79.96 12.39,85.95 78.54,85.95 82.5,81.99 B15ALT.P$5
GPA10  (via drill 0.41)
  Top 0.203: v61.47,85.24 64.72,81.99 B14ALT.P$5
  Bottom 0.203: v61.47,85.24 12.29,85.24 8.84,81.79 8.84,73.97 12.7,70.1 14.22,70.1 23.88,60.45 23.88,59.84 23.77,59.74 23.77,58.83 IC1.3 | B14.P$5 64.82,73.15 64.82,81.89 B14ALT.P$5
GPA11
  Bottom 0.203: IC1.4 24.49,58.73 24.49,57.51 26.42,55.58 31.39,55.58 35.76,59.94 35.76,67.26 41.66,73.15 46.94,73.15 B13.P$5 46.94,73.25 46.94,81.89 B13ALT.P$5
GPA12  (via drill 0.41)
  Top 0.203: v26.72,56.29 26.72,54.76 v27.43,54.05 | v34.75,53.65 55.37,53.65 62.59,46.43 64.72,46.43 B9ALT.P$5 | v64.11,43.38 63.2,43.38 62.28,42.47 62.28,41.35 64.72,38.91 64.72,37.59 B9.P$5
  Bottom 0.203: v26.72,56.29 25.09,57.91 25.09,58.73 IC1.5 | v27.43,54.05 34.34,54.05 v34.75,53.65 | v64.11,43.38 64.11,45.72 64.72,46.33 B9ALT.P$5
GPA13  (via drill 0.41)
  Top 0.203: v28.25,62.99 v25.4,60.15 | v31.19,64.52 40.54,64.52 41.15,65.13 50.7,65.13 51.31,65.73 61.27,65.73 80.57,46.43 82.5,46.43 B10ALT.P$5 82.6,46.33 82.6,37.59 B10.P$5
  Bottom 0.203: v25.4,60.15 25.6,59.94 25.6,58.83 IC1.6 | v28.25,62.99 29.67,62.99 v31.19,64.52
GPA14
  Bottom 0.203: IC1.7 26.31,58.83 26.31,60.25 13.51,73.05 11.48,73.05 B11.P$5 11.48,73.15 11.48,81.89 B11ALT.P$5
GPA15  (via drill 0.41)
  Top 0.203: v35.15,68.07 33.33,68.07 29.26,72.14 29.26,73.05 B12.P$5
  Bottom 0.203: v35.15,68.07 35.15,59.94 31.19,55.98 28.96,55.98 27.03,57.91 27.03,58.73 IC1.8 | B12ALT.P$5 29.26,81.89 29.26,73.15 B12.P$5
I2C_SCL  (via drill 0.41)
  Top 0.203: v42.47,9.35 48.56,9.35 51.21,11.99 59.44,11.99 62.28,14.83 v62.28,20.22 | v83.82,42.67 83.82,50.09 79.96,53.95 SERIAL.4 | v66.65,55.98 66.95,56.29 66.95,57.2 65.33,58.83 v56.59,58.83 53.44,58.83 49.38,54.76 33.33,54.76 31.39,56.69 v30.89,56.69
  Bottom 0.203: v42.47,9.35 40.34,9.35 IC2.26 | v62.28,20.22 74.98,32.92 74.98,33.83 v83.82,42.67 | v56.59,58.83 56.59,58.12 57.1,57.61 57.61,57.61 IC3.26 | v66.65,55.98 76.1,55.98 76.81,55.27 78.64,55.27 79.86,54.05 SERIAL.4 | v30.89,56.69 29.97,56.69 29.57,57.1 29.57,58.73 IC1.12
I2C_SDA  (via drill 0.41)
  Top 0.203: v60.01,7.78 49.21,7.78 48.9,8.1 42.7,8.1 41.43,9.37 v41.43,10.16 42.39,10.16 v47.31,15.08 | v83.03,48.74 83.03,50.16 80.49,52.7 78.74,52.7 77.47,53.98 SERIAL.3 77.31,53.98 67.94,63.34 v64.61,63.34 | v58.74,58.1 63.66,58.1 v64.61,57.15 | v34.61,55.88 v30.32,60.17
  Bottom 0.203: v41.43,10.16 41.27,10 40.32,10 IC2.27 | v60.01,7.78 83.98,31.75 83.98,41.75 84.61,42.39 84.61,47.15 v83.03,48.74 | v58.74,58.1 57.78,58.1 IC3.27 | v64.61,63.34 v64.61,57.15 | v30.32,60.17 30.32,58.9 IC1.13 | v34.61,55.88 40.01,55.88 48.74,47.15 48.74,41.59 50.64,39.69 50.64,18.41 v47.31,15.08
L0
  Bottom 0.203: R20.1 5.59,15.75 B1.P$2
L1
  Bottom 0.203: R19.1 9.65,15.75 B1.P$3
L2
  Bottom 0.203: R18.1 23.37,15.75 B2.P$2
L3
  Bottom 0.203: R17.1 27.43,15.75 B2.P$3
L4
  Bottom 0.203: R16.1 41.15,15.75 B3.P$2
L5
  Bottom 0.203: R15.1 45.21,15.75 B3.P$3
L6
  Bottom 0.203: R14.1 58.93,15.75 B4.P$2
L7
  Bottom 0.203: R13.1 62.99,15.75 B4.P$3
L8
  Bottom 0.203: R12.1 76.71,15.75 B5.P$2
L9
  Bottom 0.203: R11.1 80.77,15.75 B5.P$3
L10
  Top 0.203: B6ALT.P$2 B6.P$2
  Bottom 0.203: R10.1 5.59,42.47 5.08,41.96 B6ALT.P$2
L11
  Top 0.203: B6ALT.P$3 B6.P$3
  Bottom 0.203: R9.1 9.65,42.47 10.16,41.96 B6ALT.P$3
L12
  Bottom 0.203: R8.1 23.37,42.47 22.86,41.96 B7ALT.P$2 B7.P$2
L13
  Bottom 0.203: R7.1 27.43,42.47 27.94,41.96 B7ALT.P$3 B7.P$3
L14
  Top 0.203: B8ALT.P$2 B8.P$2
  Bottom 0.203: R6.1 41.15,42.47 40.64,41.96 B8ALT.P$2
L15
  Top 0.203: B8ALT.P$3 B8.P$3
  Bottom 0.203: R5.1 45.21,42.47 45.72,41.96 B8ALT.P$3
L16
  Top 0.203: B9ALT.P$2 B9.P$2
  Bottom 0.203: R32.1 58.93,42.47 58.42,41.96 B9ALT.P$2
L17
  Top 0.203: B9.P$3 63.5,34.54 66.04,37.08 66.04,39.32 63.5,41.86 B9ALT.P$3
  Bottom 0.203: R31.1 62.99,42.47 63.5,41.96 B9ALT.P$3
L18
  Top 0.203: B10ALT.P$2 B10.P$2
  Bottom 0.203: R30.1 76.71,42.47 76.2,41.96 B10ALT.P$2
L19
  Top 0.203: B10ALT.P$3 B10.P$3
  Bottom 0.203: R29.1 80.77,42.47 81.28,41.96 B10ALT.P$3
L20
  Top 0.203: B11ALT.P$2 B11.P$2
  Bottom 0.203: R28.1 5.59,78.03 5.08,77.52 B11ALT.P$2
L21
  Top 0.203: B11ALT.P$3 B11.P$3
  Bottom 0.203: R27.1 9.65,78.03 10.16,77.52 B11ALT.P$3
L22
  Top 0.203: B12ALT.P$2 B12.P$2
  Bottom 0.203: R26.1 23.37,78.03 22.86,77.52 B12ALT.P$2
L23
  Top 0.203: B12ALT.P$3 B12.P$3
  Bottom 0.203: R25.1 27.43,78.03 27.94,77.52 B12ALT.P$3
L24
  Top 0.203: B13ALT.P$2 B13.P$2
  Bottom 0.203: R24.1 41.15,78.03 40.64,77.52 B13ALT.P$2
L25
  Top 0.203: B13ALT.P$3 B13.P$3
  Bottom 0.203: R23.1 45.21,78.03 45.72,77.52 B13ALT.P$3
L26
  Top 0.203: B14ALT.P$2 B14.P$2
  Bottom 0.203: R22.1 58.93,78.03 58.42,77.52 B14ALT.P$2
L27
  Top 0.203: B14ALT.P$3 B14.P$3
  Bottom 0.203: R21.1 62.99,78.03 63.5,77.52 B14ALT.P$3
L28
  Top 0.203: B15ALT.P$2 B15.P$2
  Bottom 0.203: R4.1 76.71,78.03 76.2,77.52 B15ALT.P$2
L29
  Top 0.203: B15ALT.P$3 B15.P$3
  Bottom 0.203: R3.1 80.77,78.03 81.28,77.52 B15ALT.P$3
N$1  (via drill 0.41)
  Top 0.203: v64.82,51.92 64.82,53.14 67.36,55.68 67.36,57.4 59.44,65.33 51.51,65.33 50.29,64.11 v41.15,64.11 | v38,68.48 32.82,73.66 32.82,75.59 v28.55,79.86
  Bottom 0.203: v64.82,51.92 64.01,51.1 63.5,51.1 IC3.13 | v41.15,64.11 41.15,65.33 v38,68.48 | v28.55,79.86 27.43,80.97 R25.2
N$2  (via drill 0.41)
  Top 0.203: v62.28,51.61 58.01,51.61 53.44,56.19 v53.24,56.19 | v49.17,65.84 34.04,65.84 v33.43,66.45
  Bottom 0.203: v62.28,51.61 63.4,51.61 IC3.12 | v53.24,56.19 50.6,58.83 50.6,64.41 v49.17,65.84 | v33.43,66.45 33.43,67.16 26.62,73.97 26.62,78.03 23.67,80.97 23.37,80.97 R26.2
N$3  (via drill 0.41)
  Top 0.203: v61.67,52.32 58.12,52.32 v53.34,57.1
  Bottom 0.203: v61.67,52.32 63.4,52.32 IC3.11 | v53.34,57.1 53.34,61.06 51,63.4 51,80.37 46.53,84.84 12.5,84.84 9.65,81.99 R27.2
N$4
  Bottom 0.203: IC2.13 46.13,2.85 47.14,2.85 58.32,14.02 58.93,14.02 59.74,14.83 59.74,15.75 62.69,18.69 62.99,18.69 R13.2
N$5
  Bottom 0.203: IC2.12 46.13,3.45 46.63,3.45 57.2,14.02 57.2,16.97 58.93,18.69 R14.2
N$6  (via drill 0.41)
  Top 0.203: v66.24,56.9 v62.38,53.03
  Bottom 0.203: v62.38,53.03 63.4,53.03 IC3.10 | v66.24,56.9 66.24,59.74 74.98,68.48 74.98,69.39 83.82,78.23 83.82,82.5 79.96,86.36 10.87,86.36 5.59,81.08 R28.2
N$7  (via drill 0.41)
  Top 0.203: v46.74,16.76 v50.9,12.6
  Bottom 0.203: v50.9,12.6 50.9,8.43 46.63,4.17 46.13,4.17 IC2.11 | v46.74,16.76 46.74,17.17 45.21,18.69 R15.2
N$8
  Bottom 0.203: IC3.9 63.5,53.54 64.21,53.54 74.98,42.77 74.98,41.35 75.69,40.64 79.25,40.64 79.96,41.35 79.96,44.6 80.77,45.41 R29.2
N$9
  Bottom 0.203: IC2.10 46.02,4.78 43.89,4.78 43.18,5.49 43.18,13.51 41.96,14.73 41.96,17.88 41.15,18.69 R16.2
N$10  (via drill 0.41)
  Top 0.203: v43.89,6.91 38.91,6.91 37.9,7.92 37.9,9.25 v30.38,16.76
  Bottom 0.203: v43.89,6.91 43.59,6.6 43.59,5.69 43.99,5.28 46.02,5.28 IC2.9 | v30.38,16.76 29.36,16.76 27.43,18.69 R17.2
N$11  (via drill 0.41)
  Top 0.203: v44.3,5.99 32.92,5.99 v25.2,13.72
  Bottom 0.203: v44.3,5.99 46.02,5.99 IC2.8 | v25.2,13.72 24.18,14.73 24.18,17.88 23.37,18.69 R18.2
N$12  (via drill 0.41)
  Top 0.203: v45.01,6.71 45.01,5.69 44.6,5.28 24.08,5.28 v12.6,16.76
  Bottom 0.203: v45.01,6.71 46.02,6.71 IC2.7 | v12.6,16.76 11.58,16.76 9.65,18.69 R19.2
N$13
  Bottom 0.203: IC3.8 63.5,54.25 64.92,54.25 74.07,45.11 76.4,45.11 76.71,45.41 R30.2
N$14
  Bottom 0.203: IC3.7 63.4,54.86 62.99,54.86 60.96,52.83 60.96,47.55 62.99,45.52 R31.2
N$15
  Bottom 0.203: IC3.6 63.4,55.58 62.99,55.58 60.55,53.14 60.55,47.14 58.93,45.52 R32.2
N$16  (via drill 0.41)
  Top 0.203: v45.01,73.86 v45.01,72.44
  Bottom 0.203: v45.01,72.44 48.06,69.39 48.06,57.71 55.37,50.39 57.61,50.39 IC3.15 | v45.01,73.86 41.96,76.91 41.96,80.16 41.15,80.97 R24.2
N$17
  Bottom 0.203: R23.2 45.21,81.99 46.43,83.21 47.55,83.21 48.46,82.3 48.46,57.91 55.27,51.1 57.61,51.1 IC3.16
N$18  (via drill 0.41)
  Top 0.203: v47.35,67.87 47.75,67.87 53.54,73.66 53.54,75.59 v57.81,79.86
  Bottom 0.203: v47.35,67.87 47.35,56.39 53.85,49.89 58.32,49.89 58.52,50.09 58.52,51.31 58.22,51.61 57.71,51.61 IC3.17 | v57.81,79.86 58.93,80.97 R22.2
N$19  (via drill 0.41)
  Top 0.203: v47.24,7.32 44.81,4.88 16.26,4.88 6.3,14.83 6.3,16.15 v4.57,17.88
  Bottom 0.203: v47.24,7.32 46.13,7.32 IC2.6 | v4.57,17.88 4.78,17.88 5.59,18.69 R20.2
N$20
  Bottom 0.203: IC2.15 40.34,2.03 44.7,2.03 45.21,1.52 58.52,1.52 75.69,18.69 76.71,18.69 R12.2
N$21  (via drill 0.41)
  Top 0.203: v64.92,2.85 v43.59,2.85
  Bottom 0.203: v43.59,2.85 40.34,2.85 IC2.16 | v64.92,2.85 76.1,14.02 76.71,14.02 77.52,14.83 77.52,15.75 80.47,18.69 80.77,18.69 R11.2
N$22
  Bottom 0.203: IC2.17 40.23,3.45 17.68,3.45 6.4,14.73 6.4,44.6 5.59,45.41 R10.2
N$23
  Bottom 0.203: IC2.18 40.23,4.17 28.45,4.17 12.7,19.91 12.7,42.37 9.65,45.41 R9.2
N$24
  Bottom 0.203: IC2.19 40.23,4.78 30.07,4.78 25.5,9.35 23.88,9.35 20.32,12.9 20.32,28.75 24.18,32.61 24.18,44.6 23.37,45.41 R8.2
N$25
  Bottom 0.203: IC2.20 40.23,5.38 36.68,5.38 28.04,14.02 27.43,14.02 26.62,14.83 26.62,44.6 27.43,45.41 R7.2
N$26
  Bottom 0.203: IC2.21 40.23,6.1 38.2,6.1 35.76,8.53 35.76,32.21 41.96,38.41 41.96,44.6 41.15,45.41 R6.2
N$27
  Bottom 0.203: R5.2 45.21,46.43 46.43,47.65 47.55,47.65 48.26,46.94 48.26,31.6 37.59,20.93 37.59,11.48 37.9,11.18 37.9,7.92 39.12,6.71 40.23,6.71 IC2.22
N$28  (via drill 0.41)
  Top 0.203: v55.17,52.32 54.86,52.32 54.76,52.22 v52.53,52.22 | v48.87,55.88 48.87,59.84 v53.65,64.62
  Bottom 0.203: v55.17,52.32 57.61,52.32 IC3.18 | v48.87,55.88 v52.53,52.22 | v53.65,64.62 53.65,67.87 59.74,73.97 59.74,78.03 62.69,80.97 62.99,80.97 R21.2
N$29  (via drill 0.41)
  Top 0.203: v59.44,53.03 61.37,53.03 64.62,56.29 64.92,56.29 65.33,56.69 v65.33,57.81
  Bottom 0.203: v59.44,53.03 57.71,53.03 IC3.19 | v65.33,57.81 65.33,67.67 71.32,73.66 71.32,75.59 76.71,80.97 R4.2
N$30
  Bottom 0.203: IC3.20 57.78,53.66 58.26,53.66 60.17,55.56 60.17,58.74 59.69,59.21 59.69,63.02 66.2,69.53 66.2,75.25 74.14,83.19 78.58,83.19 80.64,81.12 R3.2
N$33
  Bottom 0.406: C7.1 78.54,48.56 79.65,48.56 L4.1 79.65,48.77 79.65,51.21 SERIAL.2

### Text on the board
_bsilk: SKAARHOJ 2014 | PCB-BI8-3x5C3 | v10-14 | GITHUB: SKAARHOJ-Open-Engineering